# EAGLE design Schm1 (EAGLE 6.6.0)
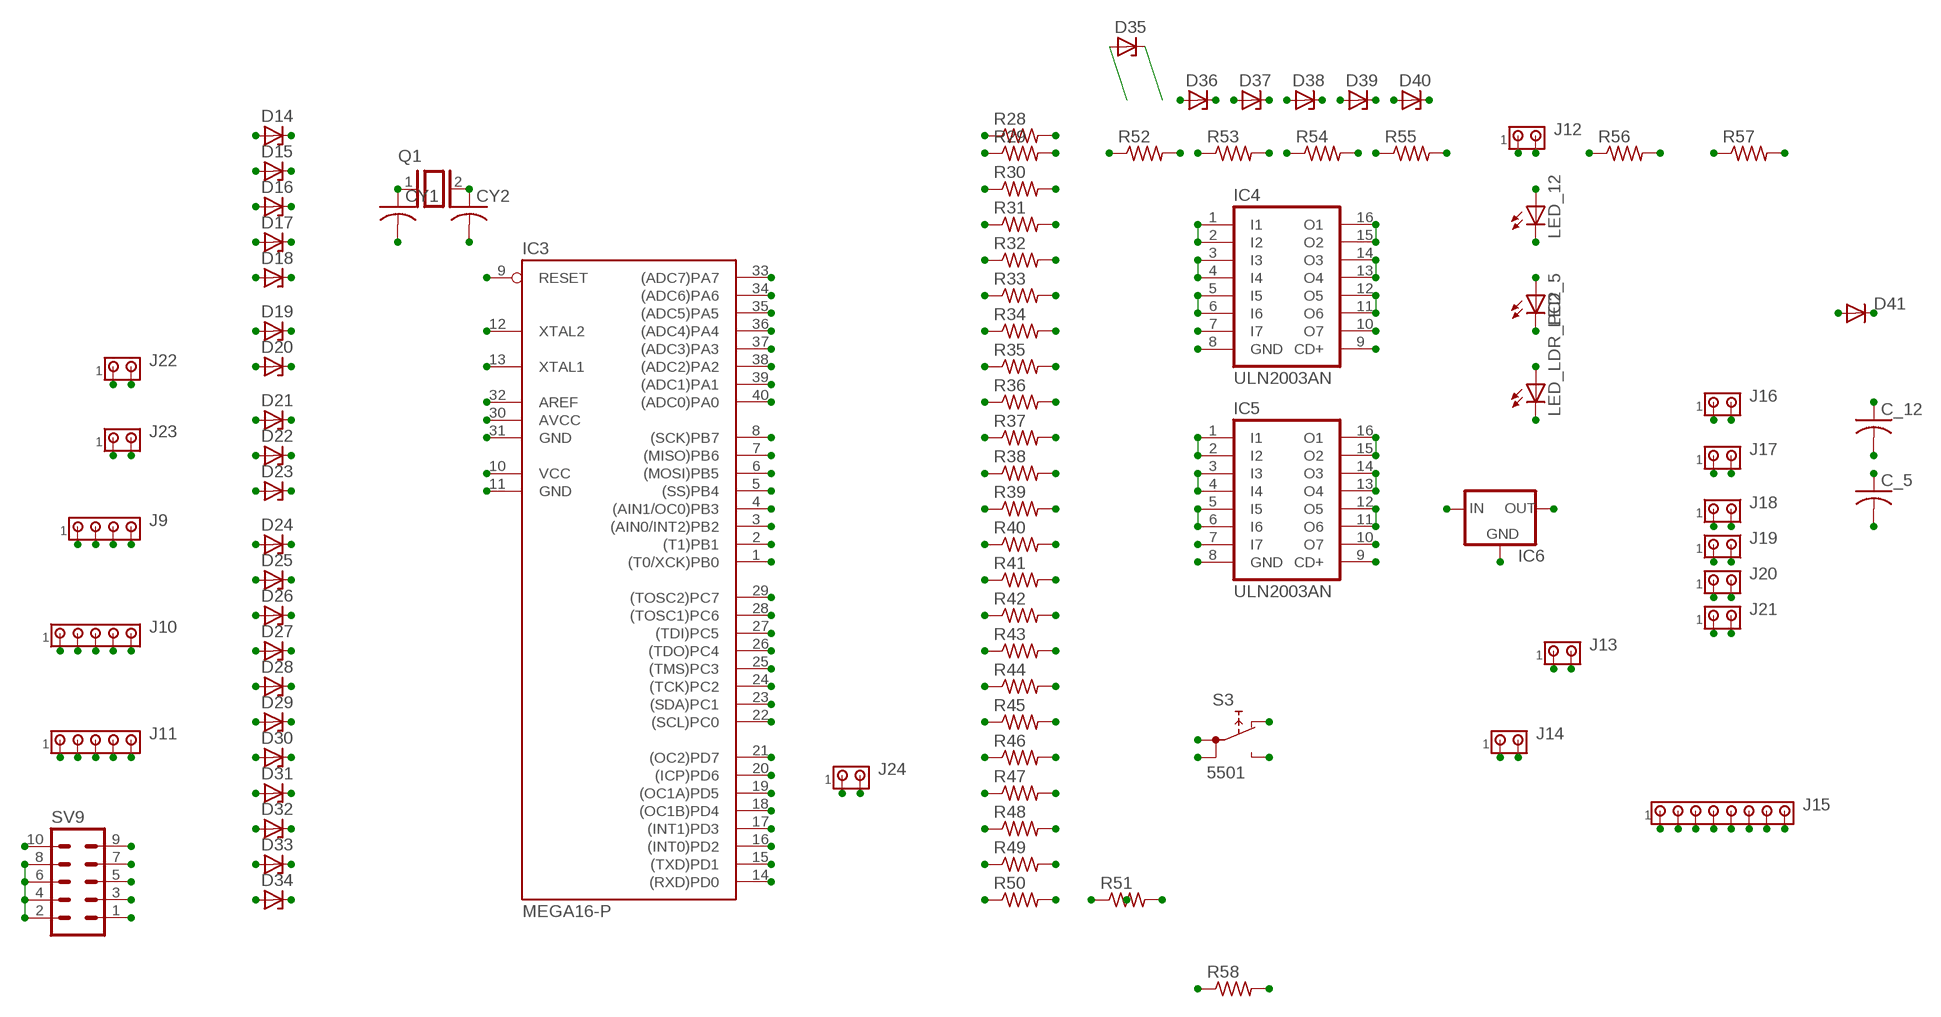
[diagram p0: schematic, sheet 1]

## Parts
C_5  C-US050-075X075  [C050-075X075]
C_12  C-US050-075X075  [C050-075X075]
CY1  C-US050-024X044  [C050-024X044]
CY2  C-US050-024X044  [C050-024X044]
D14  ZENER-DIODEDO34-7  [DO34Z7]
D15  ZENER-DIODEDO34-7  [DO34Z7]
D16  ZENER-DIODEDO34-7  [DO34Z7]
D17  ZENER-DIODEDO34-7  [DO34Z7]
D18  ZENER-DIODEDO34-7  [DO34Z7]
D19  ZENER-DIODEDO34-7  [DO34Z7]
D20  ZENER-DIODEDO34-7  [DO34Z7]
D21  ZENER-DIODEDO34-7  [DO34Z7]
D22  ZENER-DIODEDO34-7  [DO34Z7]
D23  ZENER-DIODEDO34-7  [DO34Z7]
D24  ZENER-DIODEDO34-7  [DO34Z7]
D25  ZENER-DIODEDO34-7  [DO34Z7]
D26  ZENER-DIODEDO34-7  [DO34Z7]
D27  ZENER-DIODEDO34-7  [DO34Z7]
D28  ZENER-DIODEDO34-7  [DO34Z7]
D29  ZENER-DIODEDO34-7  [DO34Z7]
D30  ZENER-DIODEDO34-7  [DO34Z7]
D31  ZENER-DIODEDO34-7  [DO34Z7]
D32  ZENER-DIODEDO34-7  [DO34Z7]
D33  ZENER-DIODEDO34-7  [DO34Z7]
D34  ZENER-DIODEDO34-7  [DO34Z7]
D35  ZENER-DIODEDO34-7  [DO34Z7]
D36  ZENER-DIODEDO34-7  [DO34Z7]
D37  ZENER-DIODEDO34-7  [DO34Z7]
D38  ZENER-DIODEDO34-7  [DO34Z7]
D39  ZENER-DIODEDO34-7  [DO34Z7]
D40  ZENER-DIODEDO34-7  [DO34Z7]
D41  DIODE-DO201-15  [DO201-15]
IC3  MEGA16-P  [DIL40]
IC4  ULN2003AN  [DIL16]
IC5  ULN2003AN  [DIL16]
IC6  78XX-TO3  [TO3-78]
J9  MTA04-100  [10X04MTA]
J10  MTA05-100  [10X05MTA]
J11  MTA05-100  [10X05MTA]
J12  MTA02-156  [1X2MTA]
J13  MTA02-156  [1X2MTA]
J14  MTA02-100  [10X02MTA]
J15  MTA08-100  [10X08MTA]
J16  MTA02-100  [10X02MTA]
J17  MTA02-100  [10X02MTA]
J18  MTA02-100  [10X02MTA]
J19  MTA02-100  [10X02MTA]
J20  MTA02-100  [10X02MTA]
J21  MTA02-100  [10X02MTA]
J22  MTA02-100  [10X02MTA]
J23  MTA02-156  [1X2MTA]
J24  MTA02-100  [10X02MTA]
LED_5  LED3MM  [LED3MM]
LED_12  LED3MM  [LED3MM]
LED_LDR_PC2  LED3MM  [LED3MM]
Q1  XTAL/S  [QS]
R28  R-US_0207/7  [0207/7]
R29  R-US_0207/7  [0207/7]
R30  R-US_0207/7  [0207/7]
R31  R-US_0207/7  [0207/7]
R32  R-US_0207/7  [0207/7]
R33  R-US_0207/7  [0207/7]
R34  R-US_0207/7  [0207/7]
R35  R-US_0207/7  [0207/7]
R36  R-US_0207/7  [0207/7]
R37  R-US_0207/7  [0207/7]
R38  R-US_0207/7  [0207/7]
R39  R-US_0207/7  [0207/7]
R40  R-US_0207/7  [0207/7]
R41  R-US_0207/7  [0207/7]
R42  R-US_0207/7  [0207/7]
R43  R-US_0207/7  [0207/7]
R44  R-US_0207/7  [0207/7]
R45  R-US_0207/7  [0207/7]
R46  R-US_0207/7  [0207/7]
R47  R-US_0207/7  [0207/7]
R48  R-US_0207/7  [0207/7]
R49  R-US_0207/7  [0207/7]
R50  R-US_0207/7  [0207/7]
R51  R-US_0207/7  [0207/7]
R52  R-US_0207/7  [0207/7]
R53  R-US_0207/7  [0207/7]
R54  R-US_0207/7  [0207/7]
R55  R-US_0207/7  [0207/7]
R56  R-US_0207/7  [0207/7]
R57  R-US_0207/7  [0207/7]
R58  R-US_0207/7  [0207/7]
S3  5501  [5501]
SV9  MA05-2  [MA05-2]

## Nets
12V1: C_12.1 D41.C IC4.9(CD+) IC5.9(CD+) IC6.2(IN) J12.1 J16.2 J17.2 J18.2 J19.2 J20.2 J21.2 J22.1 R28.2 R29.2 R30.2 R31.2 R32.2 R33.2 R34.2 R35.2 R36.2 R37.2 R38.2 R39.2 R40.2 R41.2 R42.2 R43.2 R44.2 R45.2 R46.2 R47.2 R48.2 R49.2
AREF1: IC3.32(AREF)
D: D41.A J23.1
GND1: C_5.2 C_12.2 CY1.2 CY2.2 D14.A D15.A D16.A D17.A D18.A D19.A D20.A D21.A D22.A D23.A D24.A D25.A D26.A D27.A D28.A D29.A D30.A D31.A D32.A D33.A D34.A D35.A D36.A D37.A D38.A D39.A D40.A IC3.11(GND) IC3.31(GND) IC4.8(GND) IC5.8(GND) IC6.3(GND) J9.4 J12.2 J13.2 J14.2 J22.2 J23.2 LED_5.K(C) LED_12.K(C) LED_LDR_PC2.K(C) S3.NO SV9.2 SV9.4 SV9.6 SV9.8
LED1: LED_12.A R49.1
LED2: LED_5.A R50.1
LED3: LED_LDR_PC2.A R51.2
N1: IC4.15(O2) IC4.16(O1) J16.1
N2: IC4.13(O4) IC4.14(O3) J17.1
N3: IC4.11(O6) IC4.12(O5) J18.1
N4: IC5.15(O2) IC5.16(O1) J19.1
N5: IC5.13(O4) IC5.14(O3) J20.1
N6: IC5.11(O6) IC5.12(O5) J21.1
N$29: SV9.7
N$30: S3.NC
N$162: IC4.7(I7)
N$170: IC4.10(O7)
N$178: IC5.10(O7)
N$186: IC5.7(I7)
PA0: D34.C IC3.40((ADC0)PA0) J15.1 R48.1
PA1: D33.C IC3.39((ADC1)PA1) J15.2 R47.1
PA2: D32.C IC3.38((ADC2)PA2) J15.3 R46.1
PA3: D31.C IC3.37((ADC3)PA3) J15.4 R45.1
PA4: D30.C IC3.36((ADC4)PA4) J15.5 R44.1
PA5: D29.C IC3.35((ADC5)PA5) J15.6 R43.1
PA6: D28.C IC3.34((ADC6)PA6) J15.7 R42.1
PA7: D27.C IC3.33((ADC7)PA7) J15.8 R41.1
PB0: D14.C IC3.1((T0/XCK)PB0) J10.1 R28.1
PB1: D15.C IC3.2((T1)PB1) J10.2 R29.1
PB2: D16.C IC3.3((AIN0/INT2)PB2) J10.3 R30.1
PB3: D17.C IC3.4((AIN1/OC0)PB3) J10.4 R31.1
PB4: D18.C IC3.5((SS)PB4) J10.5 R32.1
PB5: IC3.6((MOSI)PB5) SV9.9
PB6: IC3.7((MISO)PB6) SV9.1
PB7: IC3.8((SCK)PB7) SV9.3
PC0: D25.C IC3.22((SCL)PC0) J9.2 R39.1
PC1: D26.C IC3.23((SDA)PC1) J9.1 R40.1
PC2: D40.C IC3.24((TCK)PC2) R51.1 R57.1
PC3: D39.C IC3.25((TMS)PC3) R56.1
PC4: D38.C IC3.26((TDO)PC4) R55.1
PC5: D37.C IC3.27((TDI)PC5) R54.1
PC6: D36.C IC3.28((TOSC1)PC6) R53.1
PC7: D35.C IC3.29((TOSC2)PC7) R52.1
PD0: IC3.14((RXD)PD0) J24.1
PD1: IC3.15((TXD)PD1) J24.2
PD2: D19.C IC3.16((INT0)PD2) J11.1 R33.1
PD3: D20.C IC3.17((INT1)PD3) J11.2 R34.1
PD4: D21.C IC3.18((OC1B)PD4) J11.3 R35.1
PD5: D22.C IC3.19((OC1A)PD5) J11.4 R36.1
PD6: D23.C IC3.20((ICP)PD6) J11.5 R37.1
PD7: D24.C IC3.21((OC2)PD7) J9.3 R38.1
RESET1: IC3.9(RESET) R58.2 S3.1A S3.1B SV9.5
U7: IC4.1(I1) IC4.2(I2) R52.2
U8: IC4.3(I3) IC4.4(I4) R53.2
U9: IC4.5(I5) IC4.6(I6) R54.2
U10: IC5.1(I1) IC5.2(I2) R55.2
U11: IC5.3(I3) IC5.4(I4) R56.2
U12: IC5.5(I5) IC5.6(I6) R57.2
VCC1: C_5.1 IC3.10(VCC) IC3.30(AVCC) IC6.1(OUT) J13.1 J14.1 R50.2 R58.1 SV9.10
XTAL1: CY1.1 IC3.13(XTAL1) Q1.1
XTAL2: CY2.1 IC3.12(XTAL2) Q1.2

## Library data of the parts
C_5 C_12 CY1 CY2 = rcl:C-US: CAPACITOR, American symbol
D14-D40 = diode:ZENER-DIODE: Z-Diode
D41 = diode:DIODE-: DIODE
IC3 = atmel:MEGA16-P: MICROCONTROLLER 16 Kbytes FLASH 1 kbytes SRAM 512 bytes EEPROM USART 8-channel 10 bit ADC Source: avr.lbr; MPN: ATMEGA16-16PU; OC_FARNELL: 9171142; OC_NEWARK: 01M6885
IC4 IC5 = uln-udn:ULN2003A: DRIVER ARRAY
IC6 = v-reg:78XX-TO3: VOLTAGE REGULATOR
J9 = con-amp:MTA04-100: AMP connector
J10 J11 = con-amp:MTA05-100: AMP connector
J12 J13 J23 = con-amp:MTA02-156: AMP connector
J14 J16-J22 J24 = con-amp:MTA02-100: AMP connector
J15 = con-amp:MTA08-100: AMP connector
LED_5 LED_12 LED_LDR_PC2 = led:LED: LED OSRAM: - CHIPLED LG R971, LG N971, LY N971, LG Q971, LY Q971, LO R971, LY R971 LH N974, LH R974 LS Q976, LO Q976, LY Q976 LO Q996 - Hyper CHIPLED LW Q18S LB Q993, LB Q99A, LB R99A - SideLED LS A670, LO A670, LY A670, LG A670, LP A670 LB A673, LV A673, LT A673, LW A673 LH A674 LY A675 LS A676, LA A676, LO A676, LY A676, LW A676 LS A679, LY A679, LG A679 - Hyper Micro SIDELED® LS Y876, LA Y876, LO Y876, LY Y876 LT Y87S - SmartLED LW L88C, LW L88S LB L89C, LB L89S, LG L890 LS L89K, LO L89K, LY L89K LS L896, LA L896, LO L896, LY L896 - TOPLED LS T670, LO T670, LY T670, LG T670, LP T670 LSG T670, LSP T670, LSY T670, LOP T670, LYG T670 LG T671, LOG T671, LSG T671 LB T673, LV T673, LT T673, LW T673 LH T674 LS T676, LA T676, LO T676, LY T676, LB T676, LH T676, LSB T676, LW T676 LB T67C, LV T67C, LT T67C, LS T67K, LO T67K, LY T67K, LW E67C LS E67B, LA E67B, LO E67B, LY E67B, LB E67C, LV E67C, LT E67C LW T67C LS T679, LY T679, LG T679 LS T770, LO T770, LY T770, LG T770, LP T770 LB T773, LV T773, LT T773, LW T773 LH T774 LS E675, LA E675, LY E675, LS T675 LS T776, LA T776, LO T776, LY T776, LB T776 LHGB T686 LT T68C, LB T68C - Hyper Mini TOPLED® LB M676 - Mini TOPLED Santana® LG M470 LS M47K, LO M47K, LY M47K Source: http://www.osram.convergy.de LUXEON: - LUMILED® LXK2-PW12-R00, LXK2-PW12-S00, LXK2-PW14-U00, LXK2-PW14-V00 LXK2-PM12-R00, LXK2-PM12-S00, LXK2-PM14-U00 LXK2-PE12-Q00, LXK2-PE12-R00, LXK2-PE12-S00, LXK2-PE14-T00, LXK2-PE14-U00 LXK2-PB12-K00, LXK2-PB12-L00, LXK2-PB12-M00, LXK2-PB14-N00, LXK2-PB14-P00, LXK2-PB14-Q00 LXK2-PR12-L00, LXK2-PR12-M00, LXK2-PR14-Q00, LXK2-PR14-R00 LXK2-PD12-Q00, LXK2-PD12-R00, LXK2-PD12-S00 LXK2-PH12-R00, LXK2-PH12-S00 LXK2-PL12-P00, LXK2-PL12-Q00, LXK2-PL12-R00 Source: www.luxeon.com KINGBRIGHT: KA-3528ASYC Source: www.kingbright.com
Q1 = special:XTAL/S: CRYSTAL
R28-R58 = rcl:R-US_: RESISTOR, American symbol
S3 = switch:55?: PUSHBUTTON SERIES 5500 SWITCHES Source: www.e-switch.com .. 5500.pdf
SV9 = con-lstb:MA05-2: PIN HEADER; OC_FARNELL: unknown; OC_NEWARK: unknown

## Net classes
0 default: width 1.016 mm, drill 0.61 mm, clearance 0.61 mm

## Board
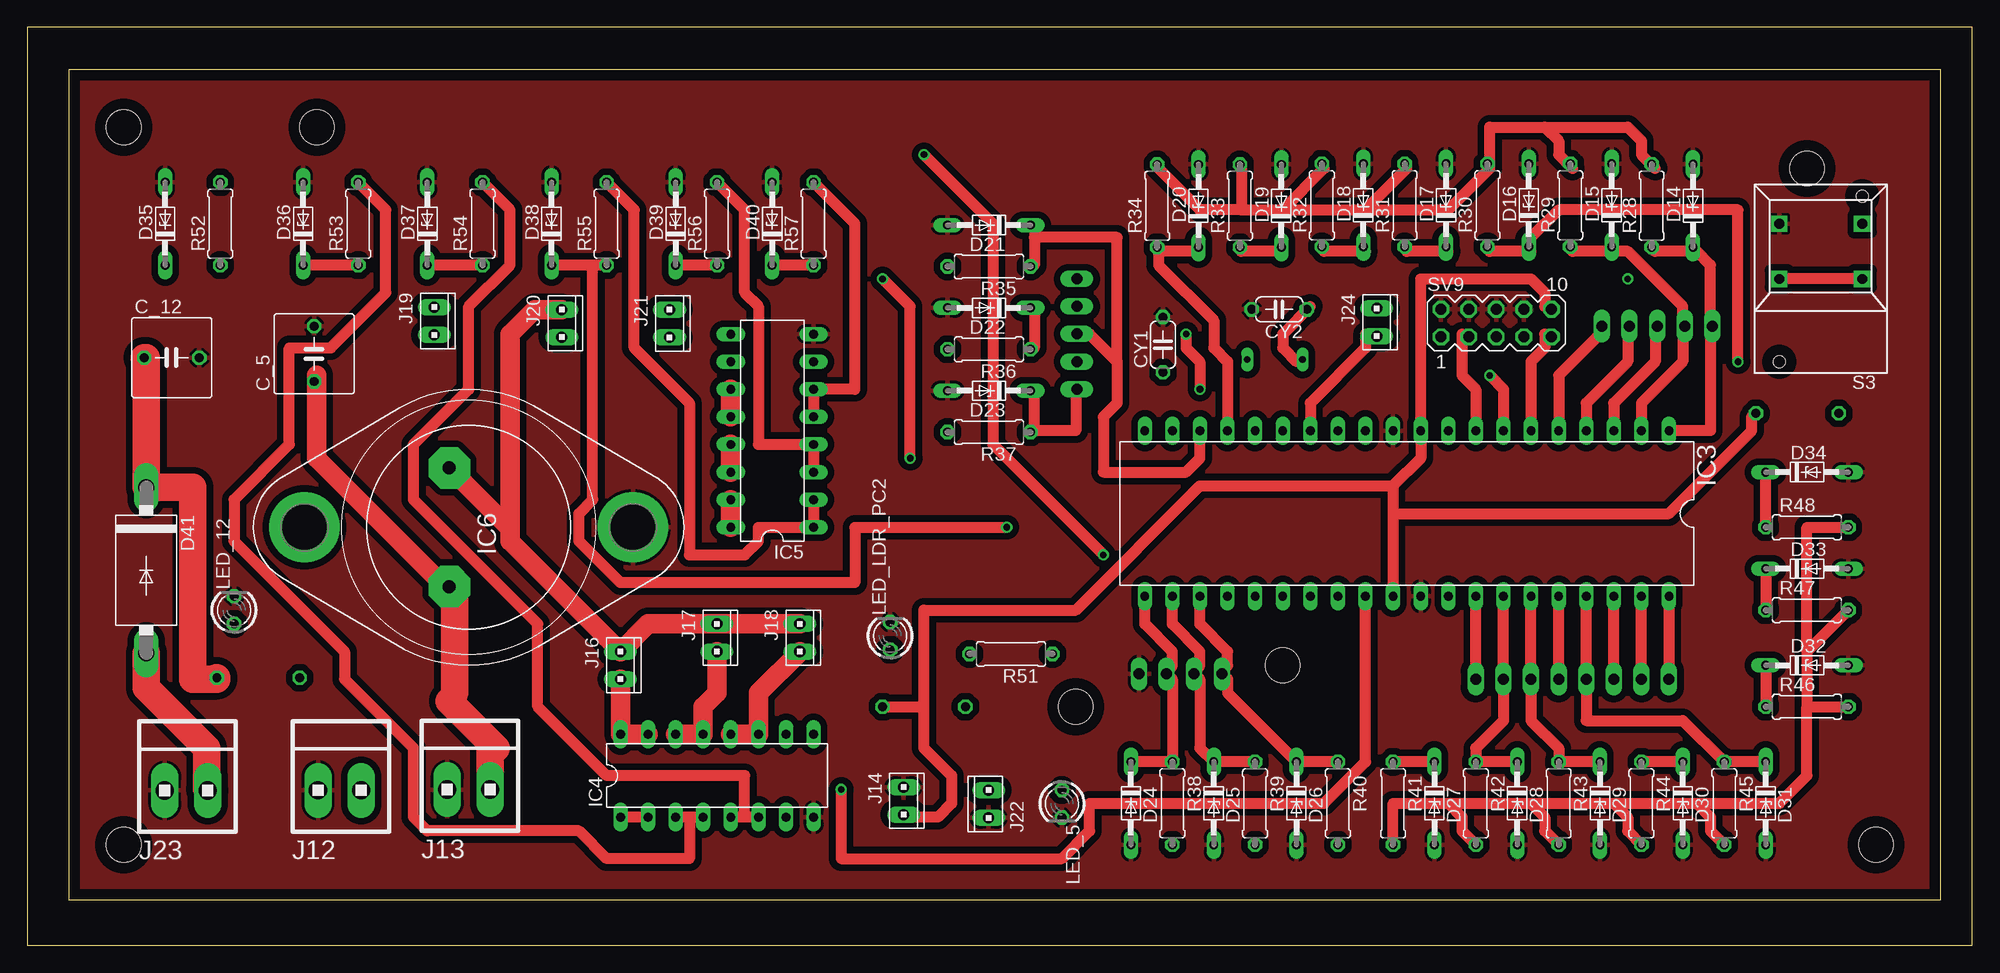
[diagram p1: board, top side]
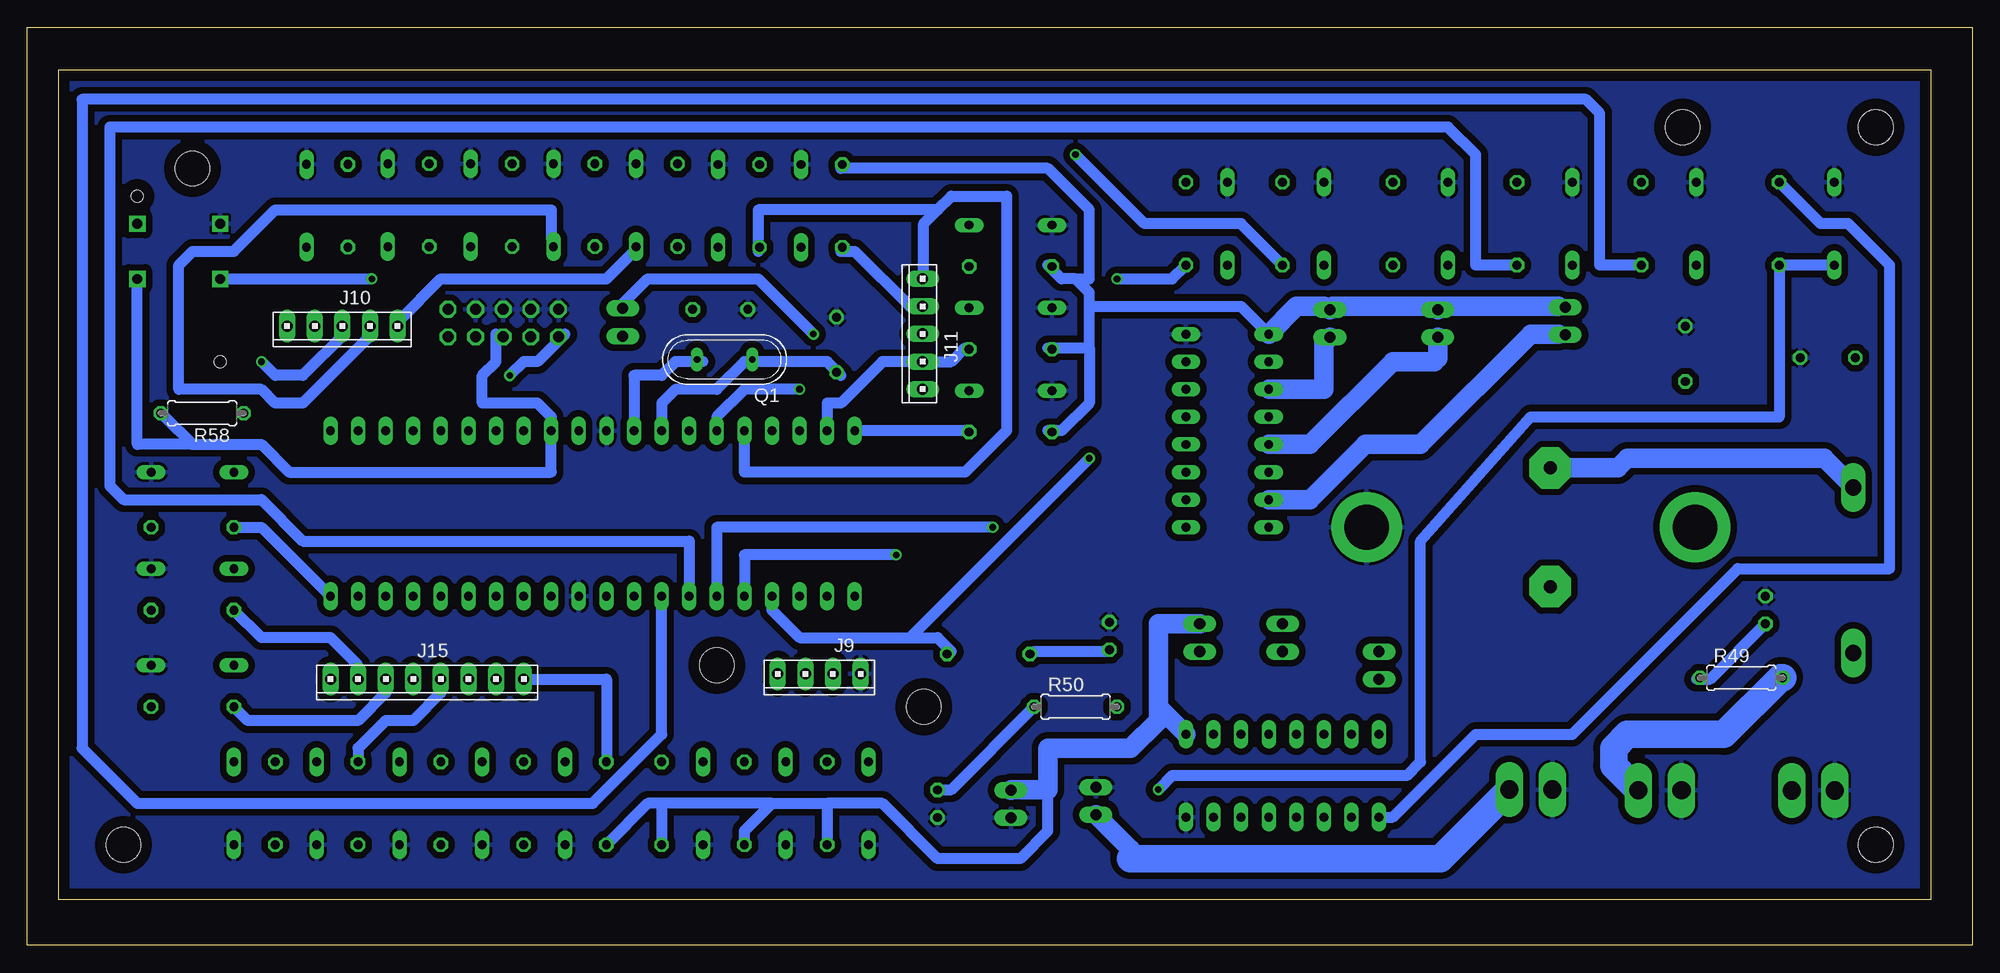
[diagram p2: board, bottom side, seen from below]

Size 179.05 x 84.51 mm. Coordinates in mm from the lower left corner, seen from the top.
Outline: 0,0 179.05,0 179.05,84.51 0,84.51 0,0
Outline: 3.81,4.19 176.13,4.19 176.13,80.57 3.81,80.57 3.81,4.19
Copper layers (1*16): Top 0.035mm / dielectric 1.5mm / Bottom 0.035mm
Design rules "default": minimum track width 10mil, minimum drill 24mil, track to track 8mil, track to pad 8mil, pad to pad 8mil, via to via 8mil, smd to smd 8mil, copper to edge 40mil, drill to drill 8mil, minimum pad ring 10mil, minimum via ring 8mil, stop-mask expansion 4mil, vias tented up to drill 0mil, thermal gap 10mil
Holes 3.2 mm at 8.89,75.31 170.18,9.27 8.89,9.27 163.83,71.5 96.52,21.97 26.67,75.31 115.57,25.78

### Footprints (pad centres in the part's own frame; a part is rotated, then mirrored left to right if it is on the bottom)
C050-075X075 = drill 0.813 octagon: 1 -2.54,0; 2 2.54,0
C050-024X044 = drill 0.813 octagon: 1 -2.54,0; 2 2.54,0
DO34Z7 = drill 0.813 long: A 3.81,0; C -3.81,0
DO201-15 = drill 1.499 long: A 7.62,0; C -7.62,0
DIL40 = drill 0.813 long: 1 -24.13,-7.62; 2 -21.59,-7.62; 3 -19.05,-7.62; 4 -16.51,-7.62; 5 -13.97,-7.62; 6 -11.43,-7.62; 7 -8.89,-7.62; 8 -6.35,-7.62; 9 -3.81,-7.62; 10 -1.27,-7.62; 11 1.27,-7.62; 12 3.81,-7.62; 13 6.35,-7.62; 14 8.89,-7.62; 15 11.43,-7.62; 16 13.97,-7.62; 17 16.51,-7.62; 18 19.05,-7.62; 19 21.59,-7.62; 20 24.13,-7.62; 21 24.13,7.62; 22 21.59,7.62; 23 19.05,7.62; 24 16.51,7.62; 25 13.97,7.62; 26 11.43,7.62; 27 8.89,7.62; 28 6.35,7.62; 29 3.81,7.62; 30 1.27,7.62; 31 -1.27,7.62; 32 -3.81,7.62; 33 -6.35,7.62; 34 -8.89,7.62; 35 -11.43,7.62; 36 -13.97,7.62; 37 -16.51,7.62; 38 -19.05,7.62; 39 -21.59,7.62; 40 -24.13,7.62
DIL16 = drill 0.813 long: 1 -8.89,-3.81; 2 -6.35,-3.81; 3 -3.81,-3.81; 4 -1.27,-3.81; 5 1.27,-3.81; 6 3.81,-3.81; 7 6.35,-3.81; 8 8.89,-3.81; 9 8.89,3.81; 10 6.35,3.81; 11 3.81,3.81; 12 1.27,3.81; 13 -1.27,3.81; 14 -3.81,3.81; 15 -6.35,3.81; 16 -8.89,3.81
TO3-78 = drill 1.194 pad 3.81 octagon: 1 -1.778,-5.461; 2 -1.778,5.461 | drill 4.115 pad 6.477: 3 15.113,0; 3@ -15.113,0
10X04MTA = drill 1.016 long: 1 3.81,0; 2 1.27,0; 3 -1.27,0; 4 -3.81,0
10X05MTA = drill 1.016 long: 1 5.08,0; 2 2.54,0; 3 0,0; 4 -2.54,0; 5 -5.08,0
1X2MTA = drill 1.676 long: 1 1.981,0; 2 -1.981,0
10X02MTA = drill 1.016 long: 1 1.27,0; 2 -1.27,0
10X08MTA = drill 1.016 long: 1 8.89,0; 2 6.35,0; 3 3.81,0; 4 1.27,0; 5 -1.27,0; 6 -3.81,0; 7 -6.35,0; 8 -8.89,0
LED3MM = drill 0.813 octagon: A -1.27,0; K 1.27,0
QS = drill 0.61 long: 1 -2.54,0; 2 2.54,0
0207/7 = drill 0.813 octagon: 1 -3.81,0; 2 3.81,0
5501 = drill 0.9 pad 1.5 square: 1A 0,3.81; 1B 0,-3.81; NC 5.08,-3.81; NO 5.08,3.81 | hole 1.1: -7.62,3.81; 7.62,-3.81
MA05-2 = drill 1.016 octagon: 1 -5.08,-1.27; 2 -5.08,1.27; 3 -2.54,-1.27; 4 -2.54,1.27; 5 0,-1.27; 6 0,1.27; 7 2.54,-1.27; 8 2.54,1.27; 9 5.08,-1.27; 10 5.08,1.27

### Placement (x,y rotation side)
C_5  26.42,54.44 90 top
C_12  13.31,54.09 0 top
CY1  104.55,55.28 90 top
CY2  115.25,58.53 180 top
D14  153.34,68.07 90 top
D15  145.85,68.12 90 top
D16  138.23,68.12 90 top
D17  130.61,68.12 90 top
D18  122.99,68.12 90 top
D19  115.44,68.06 90 top
D20  107.82,68.06 90 top
D21  88.53,66.29 180 top
D22  88.53,58.67 180 top
D23  88.53,51.05 180 top
D24  101.6,13.08 270 top
D25  109.22,13.08 270 top
D26  116.84,13.08 270 top
D27  129.54,13.08 270 top
D28  137.16,13.08 270 top
D29  144.78,13.08 270 top
D30  152.4,13.08 270 top
D31  160.02,13.08 270 top
D32  163.83,25.78 0 top
D33  163.83,34.67 0 top
D34  163.83,43.56 0 top
D35  12.7,66.42 90 top
D36  25.4,66.42 90 top
D37  36.83,66.42 90 top
D38  48.26,66.42 90 top
D39  59.69,66.42 90 top
D40  68.58,66.42 90 top
D41  10.96,34.53 270 top
IC3  127,39.75 180 top
IC4  63.5,15.62 0 top
IC5  68.58,47.37 90 top
IC6  40.64,38.48 0 top
J9  106.15,24.99 180 bottom
J10  150.04,57 180 bottom
J11  96.62,56.27 90 bottom
J12  28.75,14.27 0 top
J13  40.64,14.35 0 top
J14  80.67,13.31 270 top
J15  142.24,24.51 180 bottom
J16  54.61,25.78 270 top
J17  63.5,28.32 270 top
J18  71.12,28.32 270 top
J19  37.48,57.47 270 top
J20  49.21,57.25 270 top
J21  59.13,57.24 270 top
J22  88.49,13.02 90 top
J23  14.64,14.26 0 top
J24  124.23,57.35 270 top
LED_5  95.25,13.04 270 top
LED_12  19.05,30.86 90 top
LED_LDR_PC2  79.44,28.49 90 top
Q1  114.85,53.92 180 bottom
R28  149.53,68.07 90 top
R29  142.04,68.12 90 top
R30  134.42,68.12 90 top
R31  126.8,68.12 90 top
R32  119.18,68.12 90 top
R33  111.63,68.06 90 top
R34  104.01,68.06 90 top
R35  88.53,62.48 180 top
R36  88.53,54.86 180 top
R37  88.53,47.24 180 top
R38  105.41,13.08 270 top
R39  113.03,13.08 270 top
R40  120.65,13.08 270 top
R41  125.73,13.08 270 top
R42  133.35,13.08 270 top
R43  140.97,13.08 270 top
R44  148.59,13.08 270 top
R45  156.21,13.08 270 top
R46  163.83,21.97 0 top
R47  163.83,30.86 0 top
R48  163.83,38.48 0 top
R49  21.27,24.64 0 bottom
R50  82.55,21.97 0 bottom
R51  90.56,26.82 180 top
R52  17.78,66.42 90 top
R53  30.48,66.42 90 top
R54  41.91,66.42 90 top
R55  53.34,66.42 90 top
R56  63.5,66.42 90 top
R57  72.39,66.42 90 top
R58  162.94,48.97 180 bottom
S3  165.1,61.34 90 top
SV9  135.23,57.28 0 top

### Tracks (layer width: path | path; a pad name or v marks a point on that pad's centre or on a via)
12V1
  Top 1.016: 163.83,21.97 R46.2 | 163.83,27.05 163.83,21.97 | R47.2 163.83,27.05 | R48.2 163.83,38.48 163.83,27.05 | R42.2 132.08,10.54 132.08,11.81 130.81,13.08 | 130.81,13.08 125.73,13.08 R41.2 | R43.2 139.7,10.54 139.7,11.81 138.43,13.08 | 130.81,13.08 138.43,13.08 | R44.2 147.32,10.54 147.32,11.81 146.05,13.08 | 138.43,13.08 146.05,13.08 | R45.2 154.94,10.54 154.94,11.81 153.67,13.08 | 146.05,13.08 153.67,13.08 | 163.83,21.97 163.83,15.62 161.29,13.08 153.67,13.08 | 111.76,67.69 107.95,67.69 104.14,71.5 R34.2 | 111.76,67.69 111.76,71.5 R33.2 | 115.57,67.69 119.38,71.5 R32.2 | 111.76,67.69 115.57,67.69 | 123.19,67.69 127,71.5 R31.2 | 115.57,67.69 123.19,67.69 | 134.62,71.5 130.81,67.69 123.19,67.69 | 139.7,75.31 140.97,74.04 140.97,72.77 142.24,71.5 R29.2 | 139.7,75.31 134.62,75.31 134.62,71.5 | 134.62,71.5 R30.2 | 139.7,75.31 147.32,75.31 148.59,74.04 148.59,72.77 149.86,71.5 R28.2
  Top 1.778: J18.2 J17.2 57.15,29.59 J16.2 44.45,37.21 44.45,38.35 | J20.2 46.71,58.52 44.45,56.26 44.45,38.35 | 44.45,38.35 IC6.2
  Top 2.54: C_12.1 10.96,54.09 D41.C 15.24,42.15 15.24,24.51 17.46,24.51 R49.2
  Bottom 1.016: 105.41,13.08 R38.2 | 110.49,13.08 105.41,13.08 | 110.49,13.08 113.03,10.54 R39.2 | 120.65,13.08 R40.2 | 110.49,13.08 120.65,13.08 | R41.2 121.92,13.08 120.65,13.08 | 81.28,54.99 81.28,49.91 83.82,47.37 85.09,47.37 R37.2 | 81.28,54.99 85.09,54.99 R36.2 | 82.55,61.34 83.82,61.34 85.09,62.61 R35.2 | 82.55,61.34 81.28,60.07 81.28,58.8 | 81.28,54.99 81.28,58.8 | 82.55,61.34 81.28,61.34 81.28,67.69 85.09,71.5 104.14,71.5 R34.2 | 105.41,13.08 100.33,13.08 95.25,8 87.63,8 85.09,10.54 85.09,14.35 | 59.69,58.8 J21.2 58.42,58.8 | 49.53,58.8 J20.2 48.26,58.8 | 38.1,58.8 J19.2 | IC5.9 67.31,58.8 81.28,58.8
  Bottom 1.778: 74.93,21.97 74.93,29.59 J18.2 | 74.93,21.97 IC4.9 | 74.93,21.97 74.93,20.7 77.47,18.16 85.09,18.16 85.09,14.35 88.43,14.35 J22.1 | 38.1,58.8 49.49,58.8 | 49.49,58.8 49.53,58.8 58.84,58.8 J21.2 | 49.49,58.8 J20.2 | 59.69,58.8 62.23,58.8 IC5.9 | IC6.2 32.64,43.94 31.75,44.83 13.64,44.83 D41.C
  Bottom 2.54: R49.2 17.65,24.64 22.86,19.43 31.75,19.43 33.02,18.16 33.02,16.56 J12.1
D
  Top 2.54: D41.A 10.96,23.71 16.51,18.16 16.51,14.38 J23.1
GND1
  pour Top: 3.81,80.39 176.53,80.39 176.53,4.19 3.81,4.19
  pour Bottom: 3.81,80.39 176.53,80.39 176.53,4.19 3.81,4.19
LED1
  Bottom 1.016: LED_12.A 24.13,24.51 25.4,24.51 R49.1
LED2
  Bottom 1.016: R50.1 93.98,14.35 95.25,14.35 LED_5.A
LED3
  Bottom 1.016: R51.2 86.36,27.05 80.01,27.05 LED_LDR_PC2.A
N1
  Top 1.778: J16.1 IC4.16 IC4.15
N2
  Top 1.778: IC4.14 IC4.13 62.23,21.97 63.5,23.24 J17.1
N3
  Top 1.778: IC4.12 IC4.11 67.31,23.24 J18.1
N4
  Top 1.778: IC5.16 IC5.15
  Bottom 1.016: IC5.15 63.5,41.02 | 38.1,56.26 J19.1
  Bottom 1.778: 38.1,56.26 40.64,56.26 50.8,46.1 55.88,46.1 60.96,41.02 IC5.15
N5
  Top 1.778: IC5.14 IC5.13
  Bottom 1.778: IC5.13 60.96,46.1 53.34,53.72 49.53,53.72 49.21,54.04 J20.1
N6
  Top 1.778: IC5.12 IC5.11
  Bottom 1.778: IC5.11 59.69,51.18 59.69,55.41 J21.1
PA0
  Top 1.016: R48.1 D34.C | IC3.40 J15.1
  Bottom 1.016: IC3.40 157.48,38.48 R48.1
PA1
  Top 1.016: D33.C R47.1 | J15.2 IC3.39
  Bottom 1.016: R47.1 157.48,28.32 151.13,28.32 148.59,25.78 J15.2
PA2
  Top 1.016: D32.C R46.1 | J15.3 IC3.38
  Bottom 1.016: R46.1 158.75,20.7 148.59,20.7 146.05,23.24 J15.3
PA3
  Top 1.016: D31.C R45.1 152.4,20.7 143.51,20.7 J15.4 IC3.37
PA4
  Top 1.016: D30.C R44.1 | J15.5 IC3.36
  Bottom 1.016: R44.1 148.59,18.16 146.05,20.7 143.51,20.7 140.97,23.24 J15.5
PA5
  Top 1.016: D29.C R43.1 140.97,18.16 138.43,20.7 J15.6 IC3.35
PA6
  Top 1.016: D28.C R42.1 133.35,18.16 135.89,20.7 J15.7 IC3.34
PA7
  Top 1.016: D27.C R41.1 | J15.8 IC3.33
  Bottom 1.016: R41.1 125.73,24.51 J15.8
PB0
  Top 1.016: 153.67,63.88 149.86,63.88 R28.1 | IC3.1 154.94,47.37 154.94,56.26 J10.1 154.94,57.53 154.94,62.61 153.67,63.88 | 153.67,63.88 D14.C
PB1
  Top 1.016: 146.05,63.88 142.24,63.88 R29.1 | IC3.2 148.59,49.91 152.4,53.72 152.4,56.26 J10.2 152.4,57.53 152.4,58.8 147.32,63.88 146.05,63.88 | 146.05,63.88 D15.C
PB2  (via drill 0.61)
  Top 1.016: R30.1 134.62,63.88 138.43,63.88 D16.C 138.43,65.15 140.97,67.69 157.48,67.69 v157.48,53.72 | IC3.3 146.05,49.91 149.86,53.72 149.86,56.26 J10.3
  Bottom 1.016: v157.48,53.72 156.21,52.45 153.67,52.45 149.86,56.26 J10.3
PB3
  Top 1.016: R31.1 127,63.88 130.81,63.88 D17.C | IC3.4 143.51,49.91 147.32,53.72 147.32,56.26 J10.4
  Bottom 1.016: D17.C 130.81,65.15 130.81,67.69 156.21,67.69 160.02,63.88 163.83,63.88 165.1,62.61 165.1,51.18 157.48,51.18 156.21,49.91 153.67,49.91 147.32,56.26 J10.4
PB4
  Top 1.016: R32.1 119.38,63.88 123.19,63.88 D18.C | IC3.5 140.97,52.45 144.78,56.26 J10.5
  Bottom 1.016: D18.C 123.19,63.88 125.73,61.34 140.97,61.34 144.78,57.53 J10.5
PB5
  Top 1.016: IC3.6 138.43,53.72 139.7,54.99 139.7,56.26 SV9.9
PB6  (via drill 0.61)
  Top 1.016: IC3.7 135.89,51.18 v134.62,52.45
  Bottom 1.016: v134.62,52.45 133.35,53.72 132.08,53.72 129.54,56.26 SV9.1
PB7
  Top 1.016: IC3.8 133.35,51.18 132.08,52.45 132.08,56.26 SV9.3
PC0
  Top 1.016: R39.1 D25.C 107.95,18.16 107.95,24.51 J9.2 107.95,25.78 107.95,27.05 105.41,29.59 IC3.22
PC1
  Top 1.016: R40.1 D26.C 110.49,23.24 110.49,24.51 J9.1 110.49,25.78 110.49,27.05 107.95,29.59 IC3.23
PC2  (via drill 0.61)
  Top 1.016: R57.1 D40.C | v78.74,61.34 81.28,58.8 v81.28,44.83
  Bottom 1.016: 97.79,28.32 107.95,28.32 110.49,30.86 IC3.24 | 97.79,28.32 95.25,28.32 93.98,27.05 R51.1 | R57.1 73.66,61.34 v78.74,61.34 | 97.79,28.32 v81.28,44.83
PC3  (via drill 0.61)
  Top 1.016: R56.1 D39.C | v99.06,35.94 88.9,46.1 88.9,66.42 v82.55,72.77
  Bottom 1.016: IC3.25 113.03,35.94 v99.06,35.94 | v82.55,72.77 76.2,66.42 67.31,66.42 R56.1
PC4  (via drill 0.61)
  Top 1.016: R55.1 52.07,62.61 | 52.07,62.61 D38.C | v90.17,38.48 76.2,38.48 76.2,33.4 54.61,33.4 50.8,37.21 50.8,39.75 52.07,41.02 52.07,62.61
  Bottom 1.016: IC3.26 115.57,38.48 v90.17,38.48
PC5
  Top 1.016: R54.1 D37.C
  Bottom 1.016: IC3.27 118.11,37.21 153.67,37.21 157.48,41.02 170.18,41.02 171.45,42.29 171.45,75.31 48.26,75.31 45.72,72.77 45.72,62.61 R54.1
PC6
  Top 1.016: R53.1 D36.C
  Bottom 1.016: IC3.28 120.65,19.43 127,13.08 168.91,13.08 173.99,18.16 173.99,77.85 35.56,77.85 34.29,76.58 34.29,62.61 R53.1
PC7  (via drill 0.61)
  Top 1.016: IC3.29 123.19,16.89 119.38,13.08 97.79,13.08 97.79,10.54 95.25,8 74.93,8 v74.93,14.35
  Bottom 1.016: v74.93,14.35 73.66,15.62 52.07,15.62 50.8,16.89 50.8,37.21 40.64,48.64 17.78,48.64 R52.1 D35.C
PD0
  Top 1.016: IC3.14 118.11,49.91 123.19,54.99 123.19,56.26 J24.1
PD1  (via drill 0.61)
  Top 1.016: v107.95,51.18 107.95,53.72 106.68,54.99 v106.68,56.26
  Bottom 1.016: IC3.15 115.57,48.64 113.03,51.18 v107.95,51.18 | v106.68,56.26 111.76,61.34 121.92,61.34 124.46,58.8 J24.2
PD2
  Top 1.016: R33.1 111.76,63.88 115.57,63.88 D19.C
  Bottom 1.016: IC3.16 113.03,43.56 92.71,43.56 88.9,47.37 88.9,68.96 93.98,68.96 95.25,67.69 | 95.25,67.69 96.52,66.42 96.52,61.34 J11.1 | 95.25,67.69 111.76,67.69 111.76,63.88 R33.1
PD3
  Top 1.016: 104.14,63.88 107.95,63.88 D20.C | IC3.17 110.49,53.72 109.22,54.99 109.22,57.53 104.14,62.61 104.14,63.88 | 104.14,63.88 R34.1
  Bottom 1.016: J11.2 97.79,58.8 102.87,63.88 104.14,63.88 R34.1
PD4
  Top 1.016: 92.71,65.15 92.71,66.42 D21.C | 92.71,65.15 92.71,62.61 R35.1 | IC3.18 107.95,44.83 106.68,43.56 99.06,43.56 99.06,48.64 100.33,49.91 100.33,53.72 | 100.33,53.72 97.79,56.26 J11.3 | 92.71,65.15 100.33,65.15 100.33,53.72
PD5
  Top 1.016: R36.1 92.71,54.99 92.71,58.8 D22.C
  Bottom 1.016: IC3.19 105.41,49.91 104.14,49.91 100.33,53.72 97.79,53.72 J11.4 96.52,53.72 93.98,53.72 92.71,54.99 R36.1
PD6
  Top 1.016: 92.71,47.37 96.52,47.37 96.52,51.18 J11.5 | 92.71,47.37 92.71,51.18 D23.C | 92.71,47.37 R37.1
  Bottom 1.016: IC3.20 92.71,47.37 R37.1
PD7
  Top 1.016: D24.C R38.1 105.41,24.51 J9.3 105.41,25.78 105.41,27.05 102.87,29.59 IC3.21
RESET1  (via drill 0.61)
  Top 1.016: S3.1B S3.1A
  Bottom 1.016: S3.1A v147.32,61.34 | 163.83,46.1 157.48,46.1 154.94,43.56 130.81,43.56 IC3.9 130.81,48.64 132.08,49.91 137.16,49.91 137.16,52.45 135.89,53.72 135.89,56.26 SV9.5 | 163.83,46.1 166.37,48.64 R58.2 | S3.1B 168.91,46.1 163.83,46.1
U7
  Top 1.016: IC4.2 IC4.1
  Bottom 1.016: R52.2 13.97,66.42 11.43,66.42 7.62,62.61 7.62,34.67 21.59,34.67 36.83,19.43 45.72,19.43 53.34,11.81 IC4.1
U8
  Top 1.016: IC4.4 60.96,11.81 | 60.96,11.81 IC4.3 | R53.2 33.02,67.69 33.02,60.07 27.94,54.99 24.13,54.99 24.13,46.1 19.05,41.02 19.05,37.21 29.21,27.05 29.21,24.51 35.56,18.16 35.56,11.81 36.83,10.54 50.8,10.54 53.34,8 60.96,8 60.96,11.81
U9
  Top 1.016: IC4.6 66.04,11.81 | 66.04,11.81 IC4.5 | R54.2 44.45,67.69 44.45,62.61 40.64,58.8 40.64,51.18 35.56,46.1 35.56,41.02 46.99,29.59 46.99,21.97 53.34,15.62 66.04,15.62 66.04,11.81
U10
  Top 1.016: R55.2 55.88,67.69 55.88,54.99 60.96,49.91 60.96,35.94 66.04,35.94 67.31,37.21 67.31,38.48 IC5.1 IC5.2
U11
  Top 1.016: R56.2 66.04,67.69 66.04,60.07 67.31,58.8 67.31,46.1 IC5.4 IC5.3
U12
  Top 1.016: R57.2 76.2,66.42 76.2,51.18 IC5.6 IC5.5
VCC1
  Top 1.016: 125.73,42.29 125.73,39.75 | 125.73,39.75 IC3.30 | 125.73,42.29 128.27,44.83 IC3.10 128.27,61.34 138.43,61.34 139.7,60.07 139.7,58.8 SV9.10 | 125.73,39.75 151.13,39.75 158.75,47.37 158.75,48.64 R58.1 | 125.73,42.29 107.95,42.29 96.52,30.86 82.55,30.86 82.55,21.97 | 82.55,21.97 82.55,18.16 85.09,15.62 85.09,13.08 83.82,11.81 80.9,11.81 J14.1 | R50.2 82.55,21.97 | 26.67,52.45 C_5.1 | 38.1,33.4 IC6.1 39.37,32.13 | 39.37,23.24 38.86,22.48
  Top 1.778: 26.67,52.45 26.67,44.83 39.37,32.13
  Top 2.54: 39.37,23.24 39.37,32.13 39.37,32.51 IC6.1 | 38.86,22.48 43.18,18.16 42.62,18.16 J13.1
  Bottom 1.778: 77.47,8 77.47,8.84 J14.1
  Bottom 2.54: 77.47,8 48.97,8 J13.1
XTAL1
  Bottom 1.016: 111.76,53.72 105.41,53.72 104.14,52.45 CY1.1 | IC3.13 120.65,49.91 119.38,51.18 115.57,51.18 113.03,53.72 111.76,53.72 | 111.76,53.72 Q1.1
XTAL2
  Top 1.016: Q1.2 116.84,53.72 115.57,54.99 115.57,56.26 118.11,58.8 CY2.1
  Bottom 1.016: IC3.12 123.19,52.45 120.65,52.45 119.38,53.72 116.84,53.72 Q1.2

### Text on the board
tTest: RESET | TX / RX | PC4 / / / PC3 / / / PC2 | PD2 / PD3 / PD4 / PD5 / PD6 | TX / RX | PB4 / PB3 / PB2 / PB1 / PB0 | 12V | PC2 | PC7 / / / PC6 / / / PC5 | - / PD7 / PC0 / PC1 | PA7 / PA6 / PA5 / PA4 / PA3 / PA2 / PA1 / PA0 | 5V | (-,12IN) (-,12D) (-,5)